# Altium schematic sheet relay.SchDoc: 230 VAC output relay control circuit
size A4; Date: 2023-02-10; DocumentNumber: 5; SheetNumber: 6; SheetTotal: 6
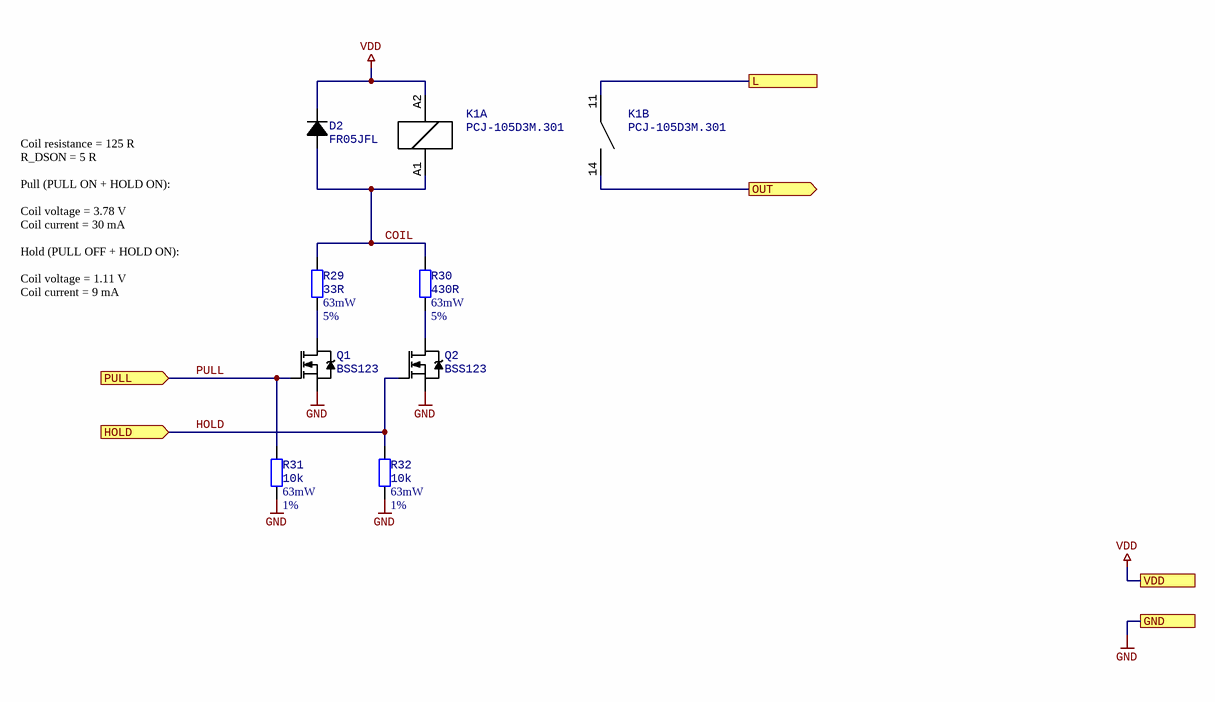
[diagram p0: relay.SchDoc]

## Parts
D2  FR05JFL  [SOD323]
K1  PCJ-105D3M.301  [1721081-2]  (parts A,B of 2)
Q1  BSS123  [sot23-3l]
Q2  BSS123  [sot23-3l]
R29  33R  Power: 63mW  Tolerance: 5%  [RES0603]
R30  430R  Power: 63mW  Tolerance: 5%  [RES0603]
R31  10k  Power: 63mW  Tolerance: 1%  [RES0603]
R32  10k  Power: 63mW  Tolerance: 1%  [RES0603]

## Ports
GND, HOLD (in), L, OUT (out), PULL (in), VDD

## Nets
GND: Q1.2(S) Q2.2(S) R31.2 R32.2 ; port GND
VDD: D2.1(K) K1.A2 ; port VDD
COIL: D2.2(A) K1.A1 R29.1 R30.1
HOLD: Q2.1(G) R32.1 ; port HOLD
L: K1.11 ; port L
OUT: K1.14 ; port OUT
PULL: Q1.1(G) R31.1 ; port PULL
NetQ1_3: Q1.3(D) R29.2
NetQ2_3: Q2.3(D) R30.2

## Notes on the sheet
- Coil resistance = 125 R
  R_DSON = 5 R
  Pull (PULL ON + HOLD ON):
  Coil voltage = 3.78 V
  Coil current = 30 mA
  Hold (PULL OFF + HOLD ON):
  Coil voltage = 1.11 V
  Coil current = 9 mA
- Title:
- Project:
- Rev:
- Address:
- Description:
- Created:
- Author:
- Company:
- Edited:
- Contact:
- Sheet
- of
- Ofiar Katynia 21
- 72-100 Goleniów
- Poland
- File:

## Library data of the parts
D2 = FR05xFL: FAST RECOVERY SURFACE MOUNT GLASS PASSIVATED RECTIFIER; Manufacturer: DC Components; V_R: 600V; I_F: 0.5A; V_F: 1.3V; Identifier: FR05JFL
K1 = PCJ-1xxD3M.301: Miniature PCB Relay PCJ; Manufacturer: TE Connectivity; Identifier: PCJ-105D3M.301
Q1 Q2 = BSS123: N-Channel Logic Level Enhancement Mode Field Effect Transistor; V_GS_tres: 2V; V_GSS: +-20V; V_DSS: 100V; I_D: 170mA; Identifier: BSS123
R29-R32 = Resistor: Generic resistor symbol; Manufacturer: *; Identifier: *; Datasheet: *
  R29: Value: 33R
  R30: Value: 430R
  R31 R32: Value: 10k